# EAGLE design mainboard (EAGLE 7.1.0)
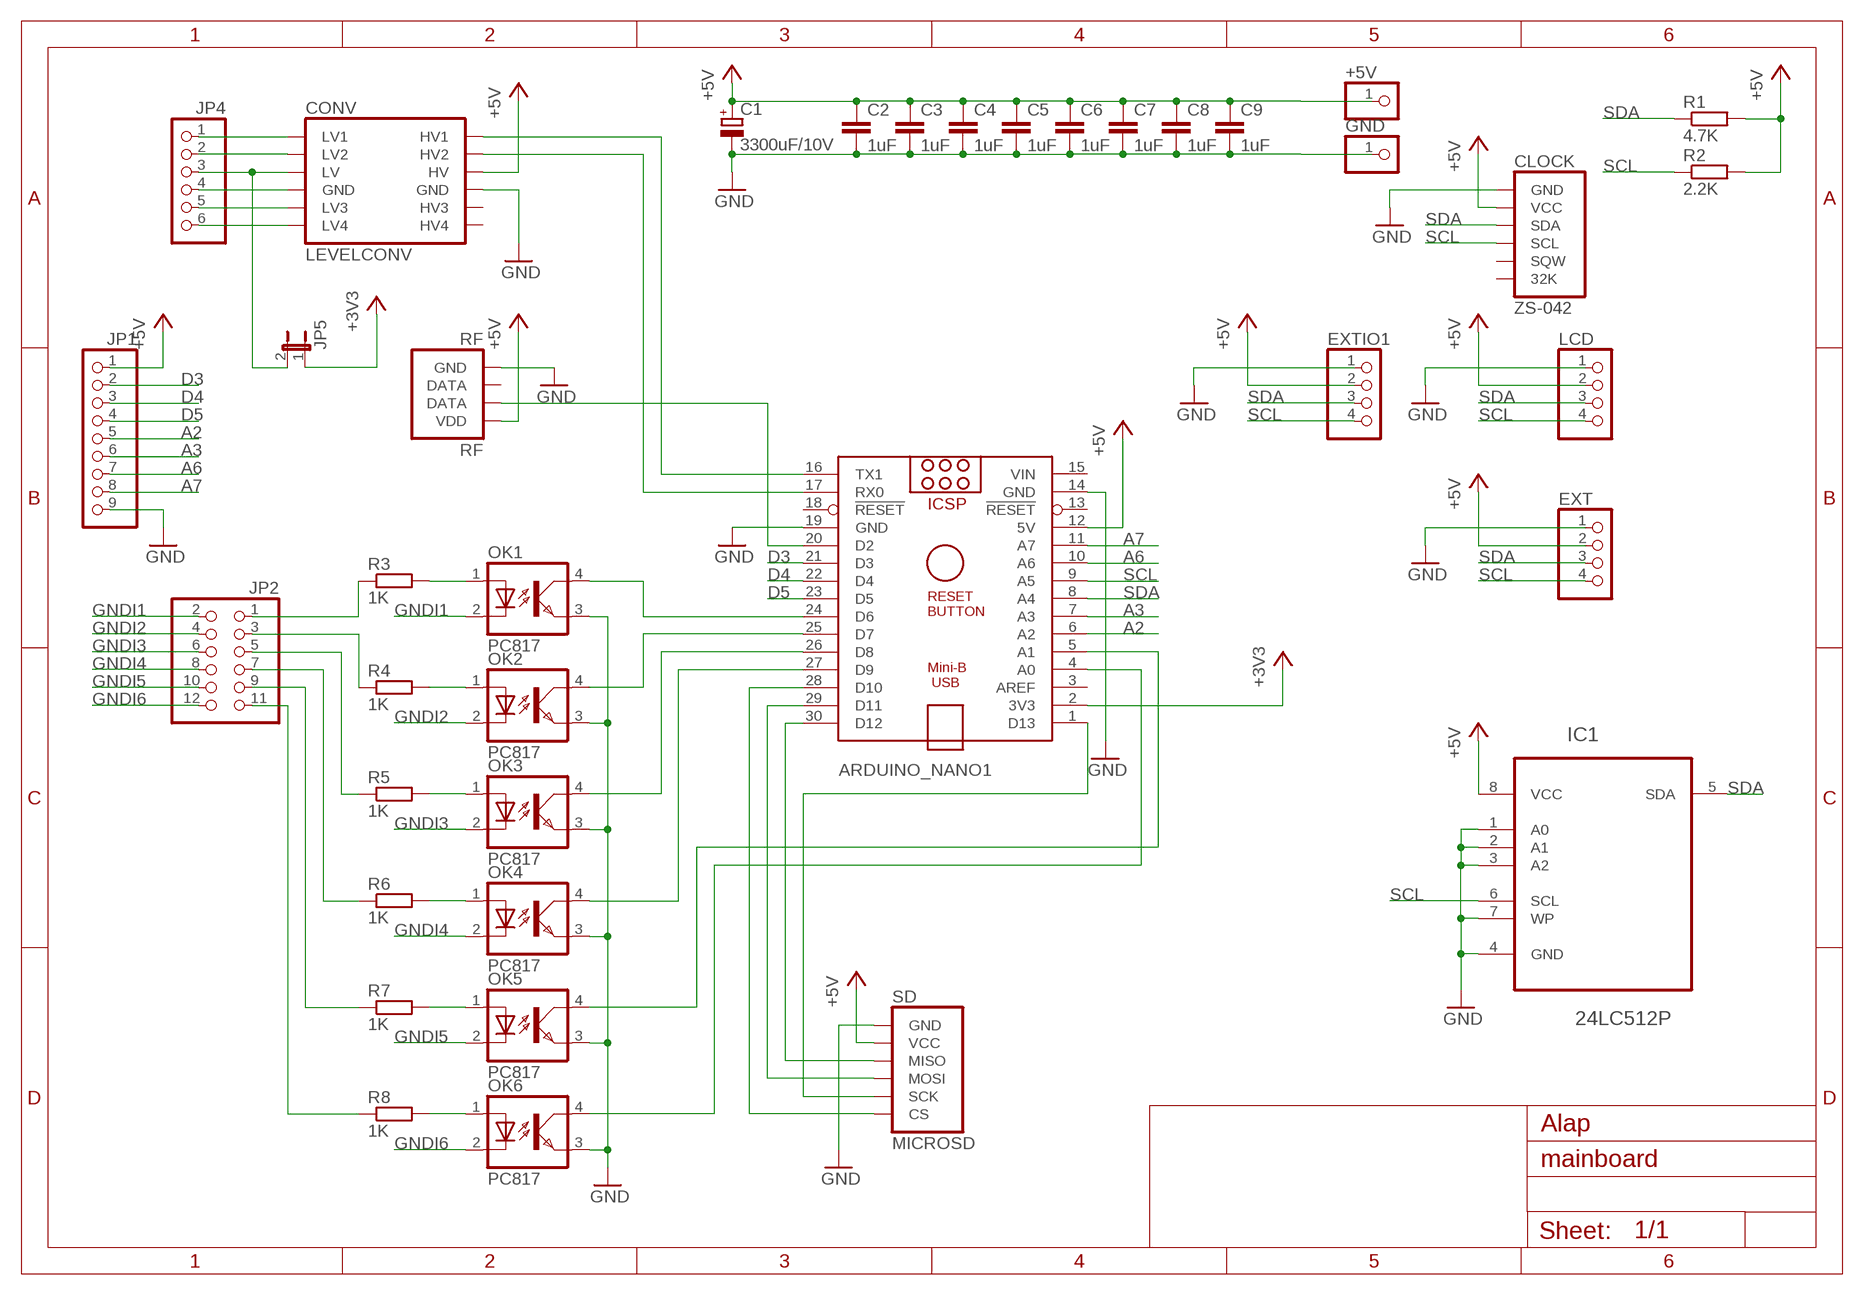
[diagram p0: schematic, sheet 1]

## Parts
+5V  PINHD-1X1  [1X01]
ARDUINO_NANO1  ARDUINO_NANO  [ARDUINO_NANO]
C1  3300uF/10V  CPOL-EUE5-10.5  [E5-10,5]
C2  1uF  C-EUC0603  [C0603]
C3  1uF  C-EUC0603  [C0603]
C4  1uF  C-EUC0603  [C0603]
C5  1uF  C-EUC0603  [C0603]
C6  1uF  C-EUC0603  [C0603]
C7  1uF  C-EUC0603  [C0603]
C8  1uF  C-EUC0603  [C0603]
C9  1uF  C-EUC0603  [C0603]
CLOCK  ZS-042  [ZS-042]
CONV  LEVELCONV  [LEVELCONV]
EXT  PINHD-1X4  [1X04]
EXTIO1  PINHD-1X4  [1X04]
GND  PINHD-1X1  [1X01]
IC1  24LC512P  AT24C512B-PU25  [DIP254P762X533-8]
JP1  PINHD-1X9  [1X09]
JP2  PINHD-2X6  [2X06]
JP4  PINHD-1X6  [1X06]
JP5  JP1E  [JP1]
LCD  PINHD-1X4  [1X04]
OK1  PC817  [DIL04]
OK2  PC817  [DIL04]
OK3  PC817  [DIL04]
OK4  PC817  [DIL04]
OK5  PC817  [DIL04]
OK6  PC817  [DIL04]
R1  4.7K  R-EU_R0603  [R0603]
R2  2.2K  R-EU_R0603  [R0603]
R3  1K  R-EU_R0603  [R0603]
R4  1K  R-EU_R0603  [R0603]
R5  1K  R-EU_R0603  [R0603]
R6  1K  R-EU_R0603  [R0603]
R7  1K  R-EU_R0603  [R0603]
R8  1K  R-EU_R0603  [R0603]
RF  RF  [RF]
SD  MICROSD  [MICROSD]

## Nets
+3V3: ARDUINO_NANO1.2(3V3) JP5.1
+5V: +5V.1 ARDUINO_NANO1.12(5V) C1.+ C2.1 C3.1 C4.1 C5.1 C6.1 C7.1 C8.1 C9.1 CLOCK.2(VCC) CONV.10(HV) EXT.2 EXTIO1.2 IC1.8(VCC) JP1.1 LCD.2 R1.2 R2.2 RF.4(VDD) SD.2(VCC)
A2: ARDUINO_NANO1.6(A2) JP1.5
A3: ARDUINO_NANO1.7(A3) JP1.6
A6: ARDUINO_NANO1.10(A6) JP1.7
A7: ARDUINO_NANO1.11(A7) JP1.8
D3: ARDUINO_NANO1.21(D3) JP1.2
D4: ARDUINO_NANO1.22(D4) JP1.3
D5: ARDUINO_NANO1.23(D5) JP1.4
GND: ARDUINO_NANO1.14(GND) ARDUINO_NANO1.19(GND) C1.- C2.2 C3.2 C4.2 C5.2 C6.2 C7.2 C8.2 C9.2 CLOCK.1(GND) CONV.9(GND) EXT.1 EXTIO1.1 GND.1 IC1.1(A0) IC1.2(A1) IC1.3(A2) IC1.4(GND) IC1.7(WP) JP1.9 LCD.1 OK1.3(EMIT) OK2.3(EMIT) OK3.3(EMIT) OK4.3(EMIT) OK5.3(EMIT) OK6.3(EMIT) RF.1(GND) SD.1(GND)
GNDI1: JP2.2 OK1.2(C)
GNDI2: JP2.4 OK2.2(C)
GNDI3: JP2.6 OK3.2(C)
GNDI4: JP2.8 OK4.2(C)
GNDI5: JP2.10 OK5.2(C)
GNDI6: JP2.12 OK6.2(C)
N$1: CONV.1(LV1) JP4.1
N$2: JP2.11 R8.1
N$3: OK1.1(A) R3.2
N$4: ARDUINO_NANO1.27(D9) OK4.4(COL)
N$5: ARDUINO_NANO1.26(D8) OK3.4(COL)
N$6: ARDUINO_NANO1.25(D7) OK2.4(COL)
N$7: JP2.9 R7.1
N$8: CONV.2(LV2) JP4.2
N$9: CONV.3(LV) JP4.3 JP5.2
N$10: CONV.5(LV3) JP4.5
N$11: CONV.6(LV4) JP4.6
N$12: CONV.4(GND) JP4.4
N$14: ARDUINO_NANO1.28(D10) SD.6(CS)
N$15: ARDUINO_NANO1.1(D13) SD.5(SCK)
N$16: ARDUINO_NANO1.29(D11) SD.4(MOSI)
N$17: ARDUINO_NANO1.30(D12) SD.3(MISO)
N$18: ARDUINO_NANO1.24(D6) OK1.4(COL)
N$19: JP2.1 R3.1
N$28: JP2.3 R4.1
N$29: ARDUINO_NANO1.4(A0) OK6.4(COL)
N$30: ARDUINO_NANO1.5(A1) OK5.4(COL)
N$33: ARDUINO_NANO1.20(D2) RF.3(DATA)
N$36: JP2.5 R5.1
N$37: JP2.7 R6.1
N$38: OK2.1(A) R4.2
N$39: OK3.1(A) R5.2
N$40: OK4.1(A) R6.2
N$41: OK5.1(A) R7.2
N$42: OK6.1(A) R8.2
N$59: ARDUINO_NANO1.16(TX1) CONV.12(HV1)
N$68: ARDUINO_NANO1.17(RX0) CONV.11(HV2)
SCL: ARDUINO_NANO1.9(A5) CLOCK.4(SCL) EXT.4 EXTIO1.4 IC1.6(SCL) LCD.4 R2.1
SDA: ARDUINO_NANO1.8(A4) CLOCK.3(SDA) EXT.3 EXTIO1.3 IC1.5(SDA) LCD.3 R1.1
Unconnected: ARDUINO_NANO1.3(AREF) ARDUINO_NANO1.13(!RESET) ARDUINO_NANO1.18(!RESET) CLOCK.5(SQW) CLOCK.6(32K) CONV.7(HV4) CONV.8(HV3) RF.2(DATA)

## Power pins joined to a net without a drawn wire
VIN: ARDUINO_NANO1.15(VIN)

## Library data of the parts
+5V GND = gate433:PINHD-1X1: PIN HEADER
ARDUINO_NANO1 = ArduinoNanoV30:ARDUINO_NANO: Arduino Nano V3.0 Overview: The Arduino Nano is a small, complete, and breadboard-friendly board based on the ATmega328 (Arduino Nano 3.x) or ATmega168 (Arduino Nano 2.x). It has more or less the same functionality of the Arduino Duemilanove, but in a different package. It lacks only a DC power jack, and works with a Mini-B USB cable instead of a standard one. The Nano was designed and is being produced by Gravitech. Specifications: Microcontroller Atmel ATmega168 or ATmega328 Operating Voltage (logic level) 5 V Input Voltage (recommended) 7-12 V Input Voltage (limits) 6-20 V Digital I/O Pins 14 (of which 6 provide PWM output) Analog Input Pins 8 DC Current per I/O Pin 40 mA Flash Memory 16 KB (ATmega168) or 32 KB (ATmega328) of which 2 KB used by bootloader SRAM 1 KB (ATmega168) or 2 KB (ATmega328) EEPROM 512 bytes (ATmega168) or 1 KB (ATmega328) Clock Speed 16 MHz Dimensions 0.73" x 1.70" Length 45 mm Width 18 mm Weigth 5 g Power: The Arduino Nano can be powered via the Mini-B USB connection, 6-20V unregulated external power supply (pin 30), or 5V regulated external power supply (pin 27). The power source is automatically selected to the highest voltage source. Memory: The ATmega168 has 16 KB of flash memory for storing code (of which 2 KB is used for the bootloader); the ATmega328 has 32 KB, (also with 2 KB used for the bootloader). The ATmega168 has 1 KB of SRAM and 512 bytes of EEPROM (which can be read and written with the EEPROM library); the ATmega328 has 2 KB of SRAM and 1 KB of EEPROM. Input and Output: Each of the 14 digital pins on the Nano can be used as an input or output, using pinMode(), digitalWrite(), and digitalRead() functions. They operate at 5 volts. Each pin can provide or receive a maximum of 40 mA and has an internal pull-up resistor (disconnected by default) of 20-50 kOhms. In addition, some pins have specialized functions. Visit Arduino - ArduinoBoardNano <https://www.arduino.cc/en/Main/ArduinoBoardNano>
C1 = resistor:CPOL-EU: POLARIZED CAPACITOR, European symbol
C2-C9 = resistor:C-EU: CAPACITOR, European symbol; SPICEPREFIX: C
CLOCK = gate433:ZS-042
CONV = gate433:LEVELCONV
EXT EXTIO1 LCD = gate433:PINHD-1X4: PIN HEADER
IC1 = gate433:AT24C512B-PU25: Two-wire Serial EEPROM; MPN: AT24C512B-PU25; OC_FARNELL: 1362655; OC_NEWARK: -; PACKAGE: PDIP-8; SUPPLIER: Atmel
JP1 = gate433:PINHD-1X9: PIN HEADER
JP2 = gate433:PINHD-2X6: PIN HEADER
JP4 = gate433:PINHD-1X6: PIN HEADER
JP5 = gate433:JP1E: JUMPER
OK1-OK6 = gate433:PC817: SHARP OPTO COUPLER; MPN: PC817X4J000F; OC_FARNELL: 9707727; OC_NEWARK: 97K7059
R1-R8 = resistor:R-EU_: RESISTOR, European symbol; SPICEPREFIX: R
RF = gate433:RF
SD = gate433:MICROSD

## Board
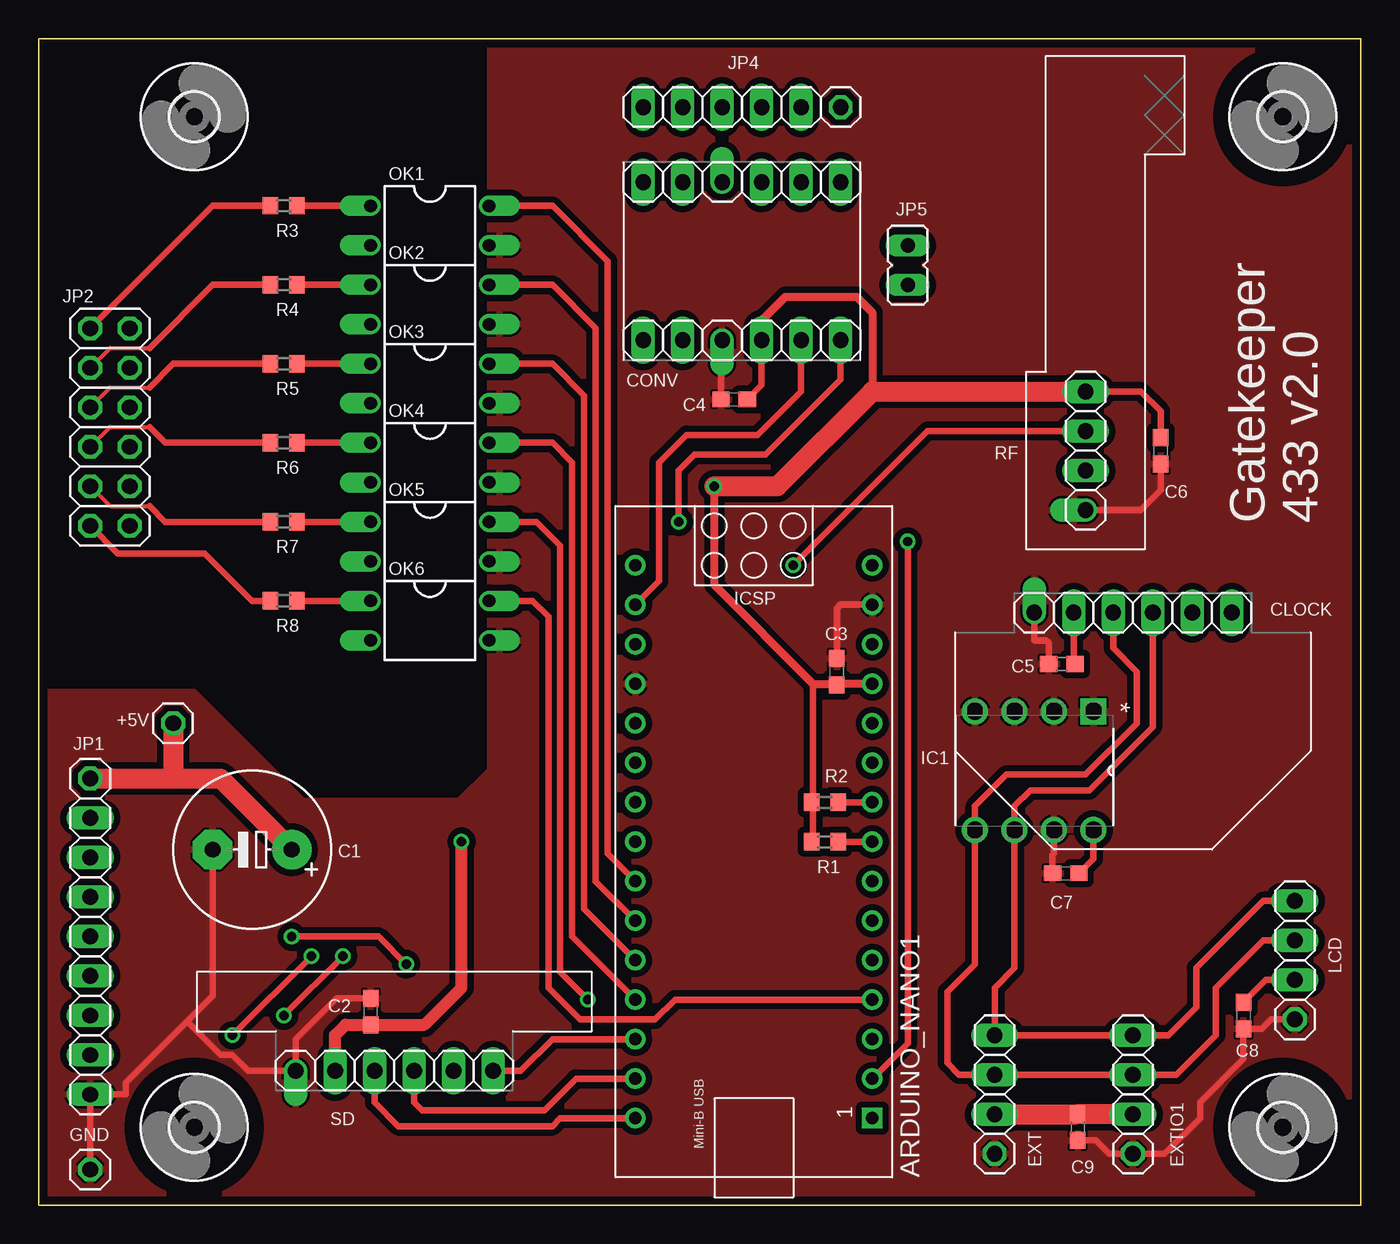
[diagram p1: board, top side]
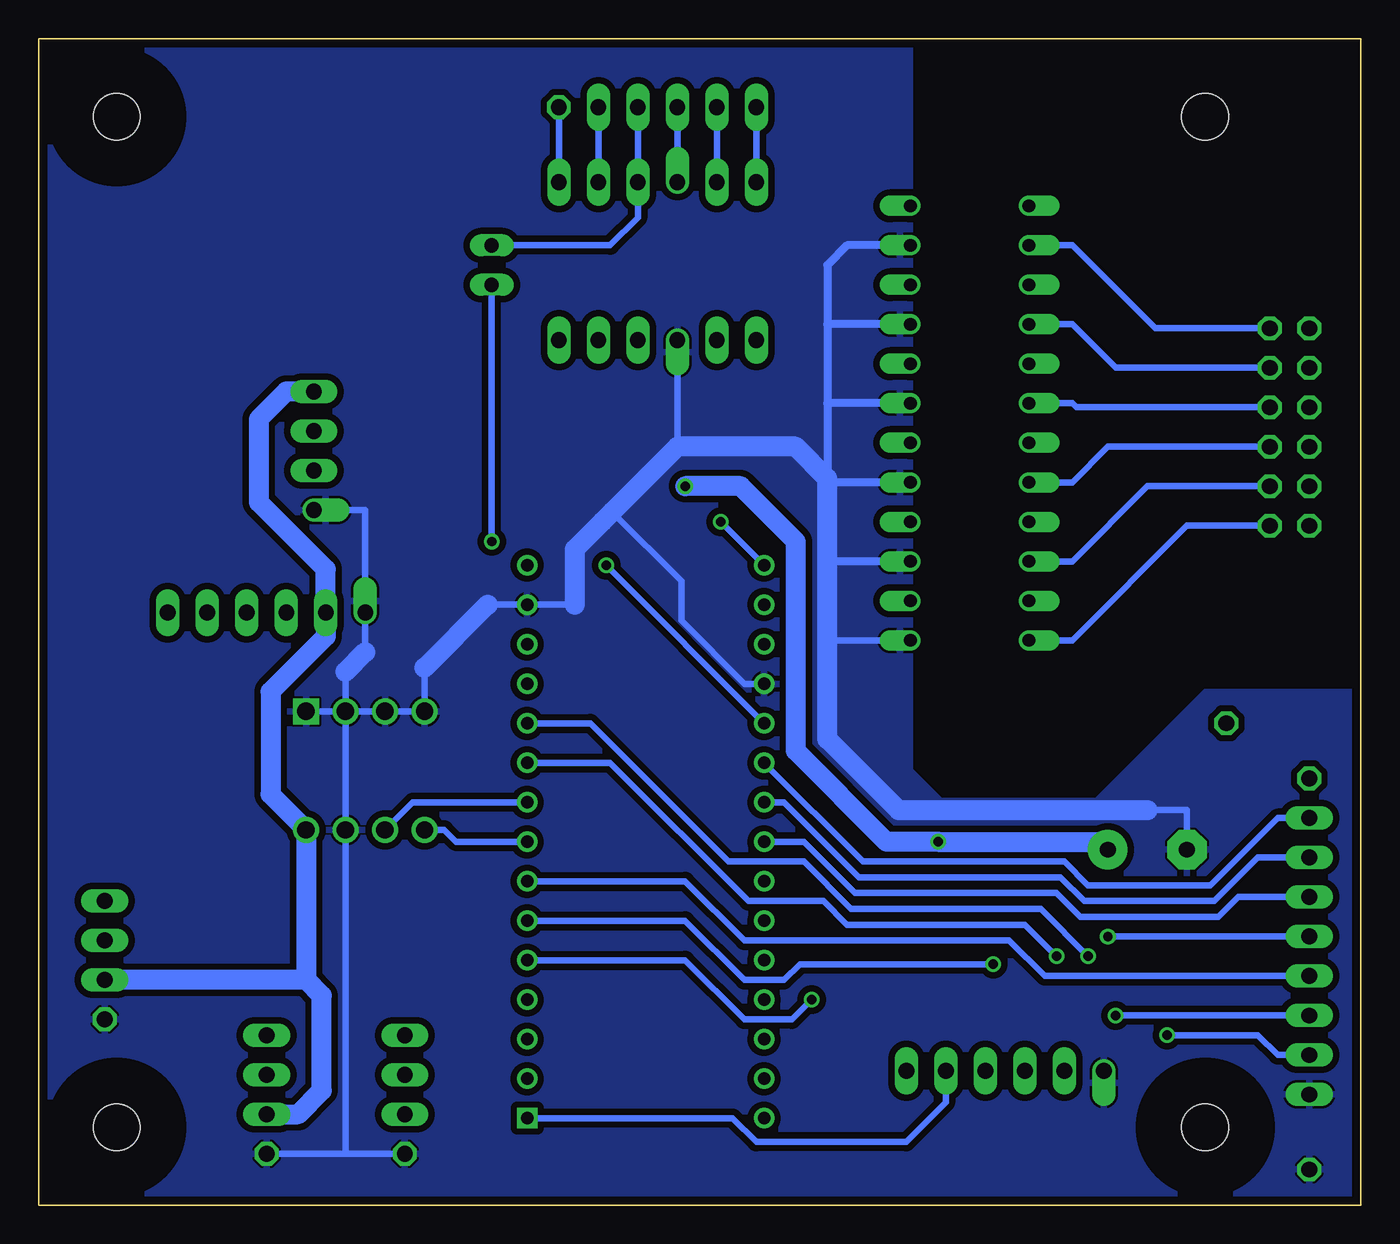
[diagram p2: board, bottom side, seen from below]

Size 85 x 75 mm. Coordinates in mm from the lower left corner, seen from the top.
Outline: 0,0 85,0 85,75 0,75 0,0
Copper layers (1*16): Top 0.035mm / dielectric 1.5mm / Bottom 0.035mm
Design rules "NYAKARUHAZ_StandardNYAK": minimum track width 6mil, minimum drill 12mil, track to track 6mil, track to pad 6mil, pad to pad 6mil, via to via 6mil, smd to smd 6mil, copper to edge 20mil, drill to drill 8mil, minimum pad ring 10mil, minimum via ring 8mil, stop-mask expansion 4mil, vias tented up to drill 0mil, thermal gap 6mil

### Footprints (pad centres in the part's own frame; a part is rotated, then mirrored left to right if it is on the bottom)
1X01 = drill 1.016 octagon: 1 0,0
ARDUINO_NANO = drill 0.8 square: 1 -20.32,-7.62 | drill 0.8: 2 -17.78,-7.62; 3 -15.24,-7.62; 4 -12.7,-7.62; 5 -10.16,-7.62; 6 -7.62,-7.62; 7 -5.08,-7.62; 8 -2.54,-7.62; 9 0,-7.62; 10 2.54,-7.62; 11 5.08,-7.62; 12 7.62,-7.62; 13 10.16,-7.62; 14 12.7,-7.62; 15 15.24,-7.62; 16 15.24,7.62; 17 12.7,7.62; 18 10.16,7.62; 19 7.62,7.62; 20 5.08,7.62; 21 2.54,7.62; 22 0,7.62; 23 -2.54,7.62; 24 -5.08,7.62; 25 -7.62,7.62; 26 -10.16,7.62; 27 -12.7,7.62; 28 -15.24,7.62; 29 -17.78,7.62; 30 -20.32,7.62
E5-10,5 = drill 1.016 pad 2.54: + -2.54,0 | drill 1.016 pad 2.54 octagon: - 2.54,0
C0603 = smd 1.1 x 1: 1 -0.85,0; 2 0.85,0
ZS-042 = drill 1.016 offset: 1 -6.35,0 | drill 1.016 long: 2 -3.81,0; 3 -1.27,0; 4 1.27,0; 5 3.81,0; 6 6.35,0
LEVELCONV = drill 1.016 long: 1 -6.35,-5.08; 2 -3.81,-5.08; 3 -1.27,-5.08; 5 3.81,-5.08; 6 6.35,-5.08; 7 6.35,5.08; 8 3.81,5.08; 10 -1.27,5.08; 11 -3.81,5.08; 12 -6.35,5.08 | drill 1.016 offset: 4 1.27,-5.08; 9 1.27,5.08
1X04 = drill 1.016 octagon: 1 -3.81,0 | drill 1.016 long: 2 -1.27,0; 3 1.27,0; 4 3.81,0
DIP254P762X533-8 = drill 1.118 square: 1 -7.62,7.62 | drill 1.118: 2 -7.62,5.08; 3 -7.62,2.54; 4 -7.62,0; 5 0,0; 6 0,2.54; 7 0,5.08; 8 0,7.62
1X09 = drill 1.016 octagon: 1 -10.16,0 | drill 1.016 long: 2 -7.62,0; 3 -5.08,0; 4 -2.54,0; 5 0,0; 6 2.54,0; 7 5.08,0; 8 7.62,0; 9 10.16,0
2X06 = drill 1.016 octagon: 1 -6.35,-1.27; 2 -6.35,1.27; 3 -3.81,-1.27; 4 -3.81,1.27; 5 -1.27,-1.27; 6 -1.27,1.27; 7 1.27,-1.27; 8 1.27,1.27; 9 3.81,-1.27; 10 3.81,1.27; 11 6.35,-1.27; 12 6.35,1.27
1X06 = drill 1.016 octagon: 1 -6.35,0 | drill 1.016 long: 2 -3.81,0; 3 -1.27,0; 4 1.27,0; 5 3.81,0; 6 6.35,0
JP1 = drill 0.914 long: 1 0,-1.27; 2 0,1.27
DIL04 = drill 0.813 offset: 1 -1.27,-3.81; 2 1.27,-3.81; 3 1.27,3.81; 4 -1.27,3.81
R0603 = smd 1 x 1.1: 1 -0.85,0; 2 0.85,0
RF = drill 1.016 offset: 1 -3.81,0 | drill 1.016 long: 2 -1.27,0; 3 1.27,0; 4 3.81,0
MICROSD = drill 1.016 offset: 1 -6.35,0 | drill 1.016 long: 2 -3.81,0; 3 -1.27,0; 4 1.27,0; 5 3.81,0; 6 6.35,0
3,0 = hole 3: 0,0

### Placement (x,y rotation side)
+5V  8.64,30.99 0 top
ARDUINO_NANO1  45.97,25.91 90 top
C1  13.72,22.86 180 top
C2  21.34,12.45 90 top
C3  51.31,34.29 90 top
C4  44.7,51.82 180 top
C5  65.79,34.8 180 top
C6  72.14,48.51 270 top
C7  66.04,21.34 180 top
C8  77.47,12.19 270 top
C9  66.8,5 270 top
CLOCK  70.36,38.1 0 top
CONV  45.21,60.71 180 top
EXT  61.47,7.11 90 top
EXTIO1  70.36,7.11 90 top
GND  3.3,2.29 0 top
IC1  60.2,24.13 270 top
JP1  3.3,17.27 270 top
JP2  4.57,50.04 270 top
JP4  45.21,70.61 180 top
JP5  55.88,60.45 0 top
LCD  80.77,15.75 90 top
OK1  25.15,62.99 270 top
OK2  25.15,57.91 270 top
OK3  25.15,52.83 270 top
OK4  25.15,47.75 270 top
OK5  25.15,42.67 270 top
OK6  25.15,37.59 270 top
R1  50.55,23.37 180 top
R2  50.55,25.91 180 top
R3  15.75,64.26 0 top
R4  15.75,59.18 0 top
R5  15.75,54.1 0 top
R6  15.75,49.02 0 top
R7  15.75,43.94 0 top
R8  15.75,38.86 0 top
RF  67.31,48.51 90 top
SD  22.86,8.64 0 top
U$1  [3,0]  10,5 0 top
U$2  [3,0]  80,5 0 top
U$3  [3,0]  80,70 0 top
U$4  [3,0]  10,70 0 top

### Tracks (layer width: path | path; a pad name or v marks a point on that pad's centre or on a via)
+3V3  (via drill 0.6)
  Top 0.406: ARDUINO_NANO1.2 55.88,10.41 v55.88,42.67
  Bottom 0.406: v55.88,42.67 JP5.1
+5V  (via drill 0.6)
  Top 0.406: 51.5,33.53 C3.1 51.4,33.53 | IC1.8 67.82,23.88 67.82,22.26 C7.1 | C6.1 72.14,51.05 70.87,52.32 67.82,52.32 RF.4 | CONV.10 46.48,52.74 C4.1 | 49.78,33.53 49.78,26 R2.2 49.78,25.82 49.78,24.64 49.78,23.46 R1.2 | C5.1 66.55,34.89 CLOCK.2 | C8.1 78.91,14.48 LCD.2 | 66.81,5.84 C9.1
  Top 0.508: CONV.10 46.48,56.9 48.01,58.42 52.58,58.42 53.59,57.4 53.59,52.32 | ARDUINO_NANO1.12 51.4,33.53 | C3.1 51.22,33.53 49.78,33.53 43.43,39.88 v43.43,46.23
  Top 0.762: SD.2 19.05,10.92 19.72,11.6 C2.1 24.8,11.6 27.18,13.97 v27.18,23.37
  Top 1.27: JP1.1 8.64,27.43 | 8.64,27.43 11.68,27.43 C1.+ | +5V.1 8.64,27.43 | v43.43,46.23 47.5,46.23 53.59,52.32 67.82,52.32 | EXTIO1.2 66.81,5.84 | EXT.2 C9.1
  Bottom 1.27: C1.+ 16.76,23.37 v27.18,23.37 30.48,23.37 36.32,29.21 36.32,42.67 39.88,46.23 v43.43,46.23 | RF.4 69.09,52.32 70.87,50.55 70.87,45.21 66.55,40.89 CLOCK.2 66.55,36.58 70.1,33.02 70.1,26.42 IC1.8 67.82,14.48 | 67.82,14.48 LCD.2 | EXTIO1.2 68.33,5.84 66.8,7.37 66.8,13.46 67.82,14.48
A2  (via drill 0.6)
  Top 0.406: v16.26,17.27 21.84,17.27 v23.62,15.49
  Bottom 0.406: ARDUINO_NANO1.6 43.43,18.29 39.62,14.48 37.08,14.48 36.07,15.49 v23.62,15.49 | JP1.5 v16.26,17.27
A3
  Bottom 0.406: ARDUINO_NANO1.7 43.43,20.83 39.62,17.02 22.61,17.02 20.32,14.73 JP1.6
A6  (via drill 0.6)
  Top 0.406: v15.75,12.19 v19.56,16
  Bottom 0.406: ARDUINO_NANO1.10 48.26,28.45 39.37,19.56 34.54,19.56 33.02,18.03 21.59,18.03 v19.56,16 | JP1.7 v15.75,12.19
A7  (via drill 0.6)
  Top 0.406: v17.53,16 v12.45,10.92
  Bottom 0.406: ARDUINO_NANO1.11 49.53,30.99 40.64,22.1 35.81,22.1 32.77,19.05 20.57,19.05 v17.53,16 | JP1.8 5.33,9.65 6.6,10.92 v12.45,10.92
D3
  Bottom 0.406: ARDUINO_NANO1.21 32,22.1 19.05,22.1 17.53,20.57 9.65,20.57 5.33,24.89 JP1.2
D4
  Bottom 0.406: ARDUINO_NANO1.22 37.08,25.91 32.26,21.08 19.3,21.08 17.78,19.56 9.4,19.56 6.6,22.35 JP1.3
D5
  Bottom 0.406: ARDUINO_NANO1.23 35.81,23.37 32.51,20.07 19.56,20.07 18.03,18.54 9.14,18.54 7.87,19.81 3.56,19.81 JP1.4
GND
  Top 0.406: 9.53,11.81 11.68,9.65 12.45,9.65 13.46,8.64 SD.1 16.51,10.67 19.14,13.3 C2.2 | C6.2 72.14,45.97 70.87,44.7 RF.1 | C3.2 51.31,36.32 51.31,38.35 51.56,38.61 ARDUINO_NANO1.14 | C4.2 43.85,55.54 CONV.9 | GND.1 JP1.9 5.59,7.11 5.59,7.87 9.53,11.81 | C1.- 11.18,13.46 9.53,11.81 | C7.2 65.19,22.52 65.28,22.61 IC1.7 | CLOCK.1 64.01,36.32 64.77,36.32 64.94,36.16 C5.2 | LCD.1 79.25,11.94 78.65,11.34 C8.2 77.47,9.4 74.68,6.6 74.68,5.59 72.39,3.3 EXTIO1.1 68.83,3.3 67.98,4.15 C9.2
  Bottom 0.406: 34.29,46.48 34.29,46.74 | OK6.3 34.29,36.32 | CONV.9 43.94,48.77 | C1.- 11.18,25.4 13.72,25.4 | 50.55,38.61 ARDUINO_NANO1.14 56.13,38.61 | ARDUINO_NANO1.19 39.62,33.53 43.69,37.59 43.69,40.13 48.13,44.58 | 64.01,35.56 CLOCK.1 64.01,44.7 RF.1 | 60.2,34.54 IC1.4 IC1.3 IC1.2 | 65.28,34.29 IC1.2 | IC1.2 IC1.1 | IC1.2 IC1.7 65.28,3.3 | EXT.1 65.28,3.3 | EXTIO1.1 65.28,3.3
  Bottom 0.508: OK1.3 33.02,61.72 34.29,60.45 34.29,56.64 | 34.29,56.64 34.29,51.56 | 34.29,51.56 34.29,46.48 OK4.3 | OK2.3 34.29,56.64 | OK3.3 34.29,51.56 | OK5.3 34.29,41.4
  Bottom 1.27: 34.29,46.48 34.29,41.4 34.29,36.32 34.29,29.97 29.72,25.4 13.72,25.4 | 34.29,46.74 36.32,48.77 43.94,48.77 48.13,44.58 48.77,43.94 50.55,42.16 50.55,38.61 | 64.01,35.56 65.28,34.29 | 56.13,38.61 60.2,34.54
  pour Bottom (isolate 0.406): 0,33 10,33 17,26 27,26 29,28 29,75 85,75 85,0 0,0
  pour Top (isolate 0.406): 0,33 10,33 17,26 27,26 29,28 29,75 85,75 85,0 0,0
GNDI1
  Bottom 0.406: JP2.2 13.21,56.39 18.54,61.72 OK1.2
GNDI2
  Bottom 0.406: JP2.4 15.75,53.85 18.54,56.64 OK2.2
GNDI3
  Bottom 0.406: JP2.6 18.29,51.31 18.54,51.56 OK3.2
GNDI4
  Bottom 0.406: OK4.2 18.54,46.48 16.26,48.77 JP2.8
GNDI5
  Bottom 0.406: OK5.2 18.54,41.4 13.72,46.23 JP2.10
GNDI6
  Bottom 0.406: OK6.2 18.54,36.32 11.18,43.69 JP2.12
N$1
  Bottom 0.406: JP4.1 CONV.1
N$2
  Top 0.406: JP2.11 5.08,41.91 10.67,41.91 13.72,38.86 R8.1
N$3
  Top 0.406: OK1.1 R3.2
N$4
  Top 0.406: OK4.4 33.02,49.02 34.29,47.75 34.29,17.27 ARDUINO_NANO1.27
N$5
  Top 0.406: OK3.4 33.02,54.1 35.05,52.07 35.05,19.05 ARDUINO_NANO1.26
N$6
  Top 0.406: OK2.4 33.02,59.18 35.81,56.39 35.81,20.83 ARDUINO_NANO1.25
N$7
  Top 0.254: JP2.9 4.57,44.96 7.11,44.96
  Top 0.406: 7.11,44.96 8.13,43.94 R7.1
N$8
  Bottom 0.406: JP4.2 CONV.2
N$9
  Bottom 0.406: JP4.3 CONV.3 46.48,63.5 48.26,61.72 JP5.2
N$10
  Bottom 0.406: JP4.5 CONV.5
N$11
  Bottom 0.406: JP4.6 CONV.6
N$12
  Bottom 0.406: JP4.4 CONV.4
N$14
  Top 0.406: ARDUINO_NANO1.28 33.02,10.67 30.99,8.64 SD.6
N$15
  Bottom 0.406: SD.5 26.67,6.6 29.21,4.06 38.86,4.06 40.39,5.59 ARDUINO_NANO1.1
N$16
  Top 0.406: SD.4 24.13,6.6 24.64,6.1 32.51,6.1 34.54,8.13 ARDUINO_NANO1.29
N$17
  Top 0.406: SD.3 21.59,6.6 23.11,5.08 33.02,5.08 33.53,5.59 ARDUINO_NANO1.30
N$18
  Top 0.406: OK1.4 33.02,64.26 36.58,60.71 36.58,22.61 ARDUINO_NANO1.24
N$19
  Top 0.406: R3.1 11.18,64.26 JP2.1
N$28
  Top 0.254: JP2.3 4.57,55.12 7.11,55.12
  Top 0.406: 7.11,55.12 11.18,59.18 R4.1
N$29
  Top 0.406: ARDUINO_NANO1.4 40.89,13.21 39.62,11.94 34.8,11.94 32.77,13.97 32.77,37.85 31.75,38.86 OK6.4
N$30  (via drill 0.6)
  Top 0.406: OK5.4 32,43.94 33.53,42.42 33.53,14.99 v35.31,13.21
  Bottom 0.406: ARDUINO_NANO1.5 43.43,15.75 39.62,11.94 36.58,11.94 v35.31,13.21
N$33  (via drill 0.6)
  Top 0.406: RF.3 57.15,49.78 v48.51,41.15
  Bottom 0.406: v48.51,41.15 ARDUINO_NANO1.20
N$36
  Top 0.254: JP2.5 4.57,52.58 7.11,52.58
  Top 0.406: 7.11,52.58 8.64,54.1 R5.1
N$37
  Top 0.254: JP2.7 4.57,50.04 7.11,50.04
  Top 0.406: 7.11,50.04 8.13,49.02 R6.1
N$38
  Top 0.406: OK2.1 R4.2
N$39
  Top 0.406: OK3.1 R5.2
N$40
  Top 0.406: OK4.1 R6.2
N$41
  Top 0.406: OK5.1 R7.2
N$42
  Top 0.406: OK6.1 R8.2
N$59  (via drill 0.6)
  Top 0.406: v41.15,43.94 41.15,47.24 42.16,48.26 46.74,48.26 51.56,53.09 CONV.12
  Bottom 0.406: ARDUINO_NANO1.16 v41.15,43.94
N$68
  Top 0.406: ARDUINO_NANO1.17 39.88,40.13 39.88,47.75 41.66,49.53 46.23,49.53 49.02,52.32 CONV.11
SCL
  Top 0.406: CLOCK.4 71.63,30.73 67.56,26.67 63.75,26.67 62.74,25.65 IC1.6 62.74,15.24 61.47,13.97 EXT.4 EXTIO1.4 72.64,10.92 74.42,12.7 74.42,15.24 78.74,19.56 LCD.4 | R2.1 ARDUINO_NANO1.9
  Bottom 0.406: ARDUINO_NANO1.9 60.96,25.91 IC1.6
SDA
  Top 0.406: CLOCK.3 69.09,35.81 70.61,34.29 70.61,30.99 67.31,27.69 62.23,27.69 60.2,25.65 IC1.5 60.2,15.49 58.42,13.72 58.42,9.14 59.18,8.38 EXT.3 EXTIO1.3 73.15,8.38 75.69,10.92 75.69,13.97 78.74,17.02 LCD.3 | R1.1 ARDUINO_NANO1.8
  Bottom 0.406: ARDUINO_NANO1.8 58.17,23.37 58.93,24.13 IC1.5

### Text on the board
tPlace: Gatekeeper / 433 v2.0